# Altium schematic sheet DTYS_BLOOD_PRESURE_Sch.SchDoc
size 297 x 209 mm; SheetNumber: 1; SheetTotal: 1
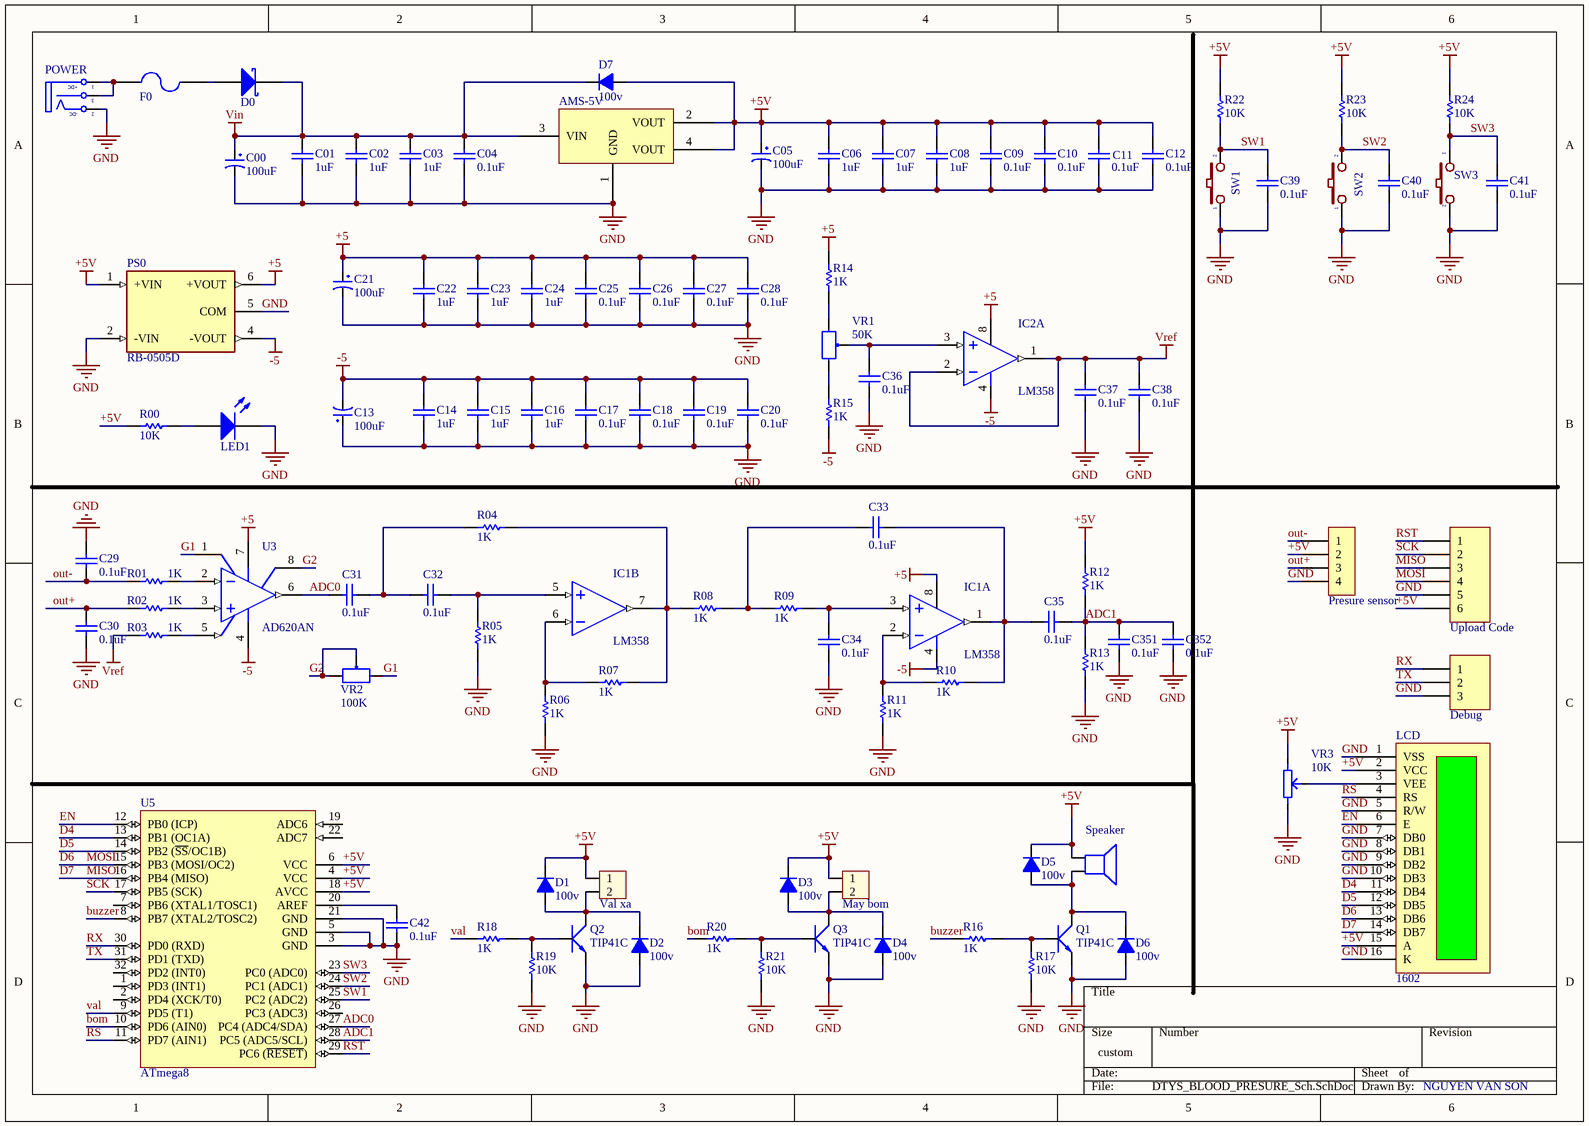
[diagram p0: DTYS_BLOOD_PRESURE_Sch.SchDoc]

## Parts
AMS-5V  AMS1117-5V  [SOT223]  (value not drawn)
C00  100uF  [tu tantalum smd7343]
C01  value 1uF  [CAP-SM-0805]  (hidden comment: Cap Non-Pol SMD)
C02  value 1uF  [CAP-SM-0805]  (hidden comment: Cap Non-Pol SMD)
C03  value 1uF  [CAP-SM-0805]  (hidden comment: Cap Non-Pol SMD)
C04  value 0.1uF  [CAP-SM-0805]  (hidden comment: Cap Non-Pol SMD)
C05  100uF  [tu tantalum smd3528]
C06  value 1uF  [CAP-SM-0805]  (hidden comment: Cap Non-Pol SMD)
C07  value 1uF  [CAP-SM-0805]  (hidden comment: Cap Non-Pol SMD)
C08  value 1uF  [CAP-SM-0805]  (hidden comment: Cap Non-Pol SMD)
C09  value 0.1uF  [CAP-SM-0805]  (hidden comment: Cap Non-Pol SMD)
C10  value 0.1uF  [CAP-SM-0805]  (hidden comment: Cap Non-Pol SMD)
C11  value 0.1uF  [CAP-SM-0805]  (hidden comment: Cap Non-Pol SMD)
C12  value 0.1uF  [CAP-SM-0805]  (hidden comment: Cap Non-Pol SMD)
C13  100uF  [tu tantalum smd3528]
C14  value 1uF  [CAP-SM-0805]  (hidden comment: Cap Non-Pol SMD)
C15  value 1uF  [CAP-SM-0805]  (hidden comment: Cap Non-Pol SMD)
C16  value 1uF  [CAP-SM-0805]  (hidden comment: Cap Non-Pol SMD)
C17  value 0.1uF  [CAP-SM-0805]  (hidden comment: Cap Non-Pol SMD)
C18  value 0.1uF  [CAP-SM-0805]  (hidden comment: Cap Non-Pol SMD)
C19  value 0.1uF  [CAP-SM-0805]  (hidden comment: Cap Non-Pol SMD)
C20  value 0.1uF  [CAP-SM-0805]  (hidden comment: Cap Non-Pol SMD)
C21  100uF  [tu tantalum smd3528]
C22  value 1uF  [CAP-SM-0805]  (hidden comment: Cap Non-Pol SMD)
C23  value 1uF  [CAP-SM-0805]  (hidden comment: Cap Non-Pol SMD)
C24  value 1uF  [CAP-SM-0805]  (hidden comment: Cap Non-Pol SMD)
C25  value 0.1uF  [CAP-SM-0805]  (hidden comment: Cap Non-Pol SMD)
C26  value 0.1uF  [CAP-SM-0805]  (hidden comment: Cap Non-Pol SMD)
C27  value 0.1uF  [CAP-SM-0805]  (hidden comment: Cap Non-Pol SMD)
C28  value 0.1uF  [CAP-SM-0805]  (hidden comment: Cap Non-Pol SMD)
C29  value 0.1uF  [CAP-SM-0805]  (hidden comment: Cap Non-Pol SMD)
C30  value 0.1uF  [CAP-SM-0805]  (hidden comment: Cap Non-Pol SMD)
C31  value 0.1uF  [CAP-SM-0805]  (hidden comment: Cap Non-Pol SMD)
C32  value 0.1uF  [CAP-SM-0805]  (hidden comment: Cap Non-Pol SMD)
C33  value 0.1uF  [CAP-SM-0805]  (hidden comment: Cap Non-Pol SMD)
C34  value 0.1uF  [CAP-SM-0805]  (hidden comment: Cap Non-Pol SMD)
C35  value 0.1uF  [CAP-SM-0805]  (hidden comment: Cap Non-Pol SMD)
C36  value 0.1uF  [CAP-SM-0805]  (hidden comment: Cap Non-Pol SMD)
C37  value 0.1uF  [CAP-SM-0805]  (hidden comment: Cap Non-Pol SMD)
C38  value 0.1uF  [CAP-SM-0805]  (hidden comment: Cap Non-Pol SMD)
C39  value 0.1uF  [CAP-SM-0805]  (hidden comment: Cap Non-Pol SMD)
C40  value 0.1uF  [CAP-SM-0805]  (hidden comment: Cap Non-Pol SMD)
C41  value 0.1uF  [CAP-SM-0805]  (hidden comment: Cap Non-Pol SMD)
C42  value 0.1uF  [CAP-SM-0805]  (hidden comment: Cap Non-Pol SMD)
C351  value 0.1uF  [CAP-SM-0805]  (hidden comment: Cap Non-Pol SMD)
C352  value 0.1uF  [CAP-SM-0805]  (hidden comment: Cap Non-Pol SMD)
D0  D Schottky  [SS34]  (value not drawn)
D1  100v  [DIODE SMA]
D2  100v  [DIODE SMA]
D3  100v  [DIODE SMA]
D4  100v  [DIODE SMA]
D5  100v  [DIODE SMA]
D6  100v  [DIODE SMA]
D7  100v  [DIODE SMA]
Debug  Header 3  [JP3]  (value not drawn)
F0  Fuse  [FUSE SMD]  (value not drawn)
H1  May bom  [XH2.54M-2]
H2  Val xa  [XH2.54M-2]
H4  Presure sensor  [XH2.54M-4]
IC1  LM358  [DIP8]  (parts A,B of 2)
IC2  LM358  [DIP8]  (part A of 2)
LCD  1602  [LCD Display 16x2]
LED1  LED  [LED-5mm]  (value not drawn)
LS0  Speaker  [SPEAKER]
POWER  JACK DC 5.5  [JACK DC 5.5]  (value not drawn)
PS0  RB-0505D  [CONV_RB-0505D]
Q1  TIP41C  [TO220H1]
Q2  TIP41C  [TO220H1]
Q3  TIP41C  [TO220H1]
R00  value 10K  [RES-SM-0805]  (hidden comment: RESISTOR SMD)
R01  value 1K  [RES-SM-0805]  (hidden comment: RESISTOR SMD)
R02  value 1K  [RES-SM-0805]  (hidden comment: RESISTOR SMD)
R03  value 1K  [RES-SM-0805]  (hidden comment: RESISTOR SMD)
R04  value 1K  [RES-SM-0805]  (hidden comment: RESISTOR SMD)
R05  value 1K  [RES-SM-0805]  (hidden comment: RESISTOR SMD)
R06  value 1K  [RES-SM-0805]  (hidden comment: RESISTOR SMD)
R07  value 1K  [RES-SM-0805]  (hidden comment: RESISTOR SMD)
R08  value 1K  [RES-SM-0805]  (hidden comment: RESISTOR SMD)
R09  value 1K  [RES-SM-0805]  (hidden comment: RESISTOR SMD)
R10  value 1K  [RES-SM-0805]  (hidden comment: RESISTOR SMD)
R11  value 1K  [RES-SM-0805]  (hidden comment: RESISTOR SMD)
R12  value 1K  [RES-SM-0805]  (hidden comment: RESISTOR SMD)
R13  value 1K  [RES-SM-0805]  (hidden comment: RESISTOR SMD)
R14  value 1K  [RES-SM-0805]  (hidden comment: RESISTOR SMD)
R15  value 1K  [RES-SM-0805]  (hidden comment: RESISTOR SMD)
R16  value 1K  [RES-SM-0805]  (hidden comment: RESISTOR SMD)
R17  value 10K  [RES-SM-0805]  (hidden comment: RESISTOR SMD)
R18  value 1K  [RES-SM-0805]  (hidden comment: RESISTOR SMD)
R19  value 10K  [RES-SM-0805]  (hidden comment: RESISTOR SMD)
R20  value 1K  [RES-SM-0805]  (hidden comment: RESISTOR SMD)
R21  value 10K  [RES-SM-0805]  (hidden comment: RESISTOR SMD)
R22  value 10K  [RES-SM-0805]  (hidden comment: RESISTOR SMD)
R23  value 10K  [RES-SM-0805]  (hidden comment: RESISTOR SMD)
R24  value 10K  [RES-SM-0805]  (hidden comment: RESISTOR SMD)
SW1  SW  [SW1-DIP]  (value not drawn)
SW2  SW  [SW1-DIP]  (value not drawn)
SW3  SW  [SW1-DIP]  (value not drawn)
U3  AD620AN  [DIP8]
U5  ATmega8  [TQFP32]
Upload_Code  Header 6  [JP6]  (value not drawn)
VR1  50K  [Bien Tro Vi Chinh Dung]
VR2  100K  [Bien Tro Vi Chinh Dung]
VR3  10K  [Bien Tro Tam Giac Dung]

## Nets
+5: C21.1 C22.2 C23.2 C24.2 C25.2 C26.2 C27.2 C28.2 IC1.8(+V) IC2.8(+V) PS0.6(+VOUT) R14.2 U3.7(V+)
+5V: AMS-5V.2(VOUT) AMS-5V.4(VOUT) C05.1 C06.2 C07.2 C08.2 C09.2 C10.2 C11.2 C12.2 D1.2(K) D3.2(K) D5.2(K) D7.1(A) H1.1 H2.1 H4.2 LCD.2(VCC) LCD.15(A) LS0.1 PS0.1(+VIN) R00.2 R12.1 R22.2 R23.2 R24.2 U5.4(VCC) U5.6(VCC) U5.18(AVCC) Upload_Code.6 VR3.3
-5: C13.2 C14.2 C15.2 C16.2 C17.2 C18.2 C19.2 C20.2 IC1.4(-V) IC2.4(-V) PS0.4(-VOUT) R15.1 U3.4(V-)
GND: AMS-5V.1(GND) C00.2 C01.1 C02.1 C03.1 C04.1 C05.2 C06.1 C07.1 C08.1 C09.1 C10.1 C11.1 C12.1 C13.1 C14.1 C15.1 C16.1 C17.1 C18.1 C19.1 C20.1 C21.2 C22.1 C23.1 C24.1 C25.1 C26.1 C27.1 C28.1 C29.2 C30.1 C34.1 C36.2 C37.1 C38.1 C39.1 C40.1 C41.1 C42.2 C351.2 C352.2 D2.1(A) D4.1(A) D6.1(A) Debug.3 H4.4 LCD.1(VSS) LCD.5(R/W) LCD.7(DB0) LCD.8(DB1) LCD.9(DB2) LCD.10(DB3) LCD.16(K) LED1.2(K) POWER.2(TN) PS0.2(-VIN) PS0.5(COM) Q1.3(E) Q2.3(E) Q3.3(E) R05.1 R06.2 R11.2 R13.2 R17.2 R19.2 R21.2 SW1.1 SW2.1 SW3.2 U5.3(GND) U5.5(GND) U5.21(GND) Upload_Code.5 VR3.1
Vin: AMS-5V.3(VIN) C00.1 C01.2 C02.2 C03.2 C04.2 D0.2(K) D7.2(K)
Vref: C37.2 C38.2 IC2.1(OUT) IC2.2(IN-) R03.2
ADC0: C31.2 U3.6(OUT) U5.27(PC4_(ADC4/SDA))
ADC1: C35.1 C351.1 C352.1 R12.2 R13.1 U5.28(PC5_(ADC5/SCL))
bom: R20.2 U5.10(PD6_(AIN0))
buzzer: R16.2 U5.8(PB7_(XTAL2/TOSC2))
D4: LCD.11(DB4) U5.13(PB1_(OC1A))
D5: LCD.12(DB5) U5.14(PB2_(~{SS}/OC1B))
D6: LCD.13(DB6) U5.15(PB3_(MOSI/OC2)) Upload_Code.4  [also labelled MOSI]
D7: LCD.14(DB7) U5.16(PB4_(MISO)) Upload_Code.3  [also labelled MISO]
EN: LCD.6(E) U5.12(PB0_(ICP))
G1: U3.1(RG) VR2.3
G2: U3.8(RG) VR2.1 VR2.2
out+: C30.2 H4.3 R02.2
out-: C29.1 H4.1 R01.2
RS: LCD.4(RS) U5.11(PD7_(AIN1))
RST: U5.29(PC6_(~{RESET})) Upload_Code.1
RX: Debug.1 U5.30(PD0_(RXD))
SCK: U5.17(PB5_(SCK)) Upload_Code.2
SW1: C39.2 R22.1 SW1.2 U5.25(PC2_(ADC2))
SW2: C40.2 R23.1 SW2.2 U5.24(PC1_(ADC1))
SW3: C41.2 R24.1 SW3.1 U5.23(PC0_(ADC0))
TX: Debug.2 U5.31(PD1_(TXD))
val: R18.2 U5.9(PD5_(T1))
NetC31_1: C31.1 C32.1 R04.2
NetC32_2: C32.2 IC1.5(IN+) R05.2
NetC33_1: C33.1 R08.1 R09.2
NetC33_2: C33.2 C35.2 IC1.1(OUT) R10.2
NetC34_2: C34.2 IC1.3(IN+) R09.1
NetC36_1: C36.1 IC2.3(IN+) VR1.2
NetC42_1: C42.1 U5.20(AREF)
NetD0_1: D0.1(A) F0.2
NetD1_1: D1.1(A) D2.2(K) H2.2 Q2.2(C)
NetD3_1: D3.1(A) D4.2(K) H1.2 Q3.2(C)
NetD5_1: D5.1(A) D6.2(K) LS0.2 Q1.2(C)
NetF0_1: F0.1 POWER.1(T) POWER.3(S)
NetIC1_2: IC1.2(IN-) R10.1 R11.1
NetIC1_6: IC1.6(IN-) R06.1 R07.1
NetIC1_7: IC1.7(OUT) R04.1 R07.2 R08.2
NetLCD_3: LCD.3(VEE) VR3.2
NetLED1_1: LED1.1(A) R00.1
NetQ1_1: Q1.1(B) R16.1 R17.1
NetQ2_1: Q2.1(B) R18.1 R19.1
NetQ3_1: Q3.1(B) R20.1 R21.1
NetR01_1: R01.1 U3.2(-IN)
NetR02_1: R02.1 U3.3(+IN)
NetR03_1: R03.1 U3.5(REF)
NetR14_1: R14.1 VR1.1
NetR15_2: R15.2 VR1.3

Not connected (* = marked no-connect by the designer): U5 1(PD3_(INT1)) 2(PD4_(XCK/T0)) 7(PB6_(XTAL1/TOSC1)) 19(ADC6) 22(ADC7) 26(PC3_(ADC3)) 32(PD2_(INT0))

## Notes on the sheet
- NGUYEN VAN SON
- (in symbol JACK DC 5.5) +DC; -DC

## Library data of the parts
AMS-5V = AMS1117 SMD: Dán; Value: AMS1117-3.3V SOT223; Don_Vi: Con; Ma_Hang: MH000596; Ghi_Chu: *; Kieu_Chan: *; Chung_Loai: Dán
C00 = Tu tantalum 100uF 50V SMD7343: Dán; Don_Vi: Con; So_Chan: 2; Ten_Linh_Kien: Tụ tantalum 107T-100uF 50V SMD7343; Ma_Hang: MH008401; Chung_Loai: Dán; Kieu_Chan: *
C01 C02 C03 C04 C06 C07 C08 C09-C12 C14-C20 C22-C42 C351 C352 = Cap Non-Pol SMD: Capacitor
C05 C13 C21 = Tu tantalum 100uF 10V SMD6032: Dán; Don_Vi: Con; So_Chan: 2; Ten_Linh_Kien: Tụ tantalum 107A-100uF 10V SMD6032; Ma_Hang: MH007594; Chung_Loai: Dán; Kieu_Chan: *
D0 = D Schottky: Schottky Diode; Published: 8-Jun-2000; LatestRevisionDate: 17-Jul-2002; LatestRevisionNote: Re-released for DXP Platform.; PackageReference: SMB; Publisher: Altium Limited; PackageDescription: DO-214-AA/SMB; 2 C-Bend Leads; Body 5.3 x 3.6 mm, inc. leads (LxW); Code_JEDEC: DO-214-AA
D1-D7 = Diode 1N4007: Cắm; Ten_Linh_Kien: Diode 1N4007 1A (DIP); Don_Vi: Con; Ma_Hang: MH001063; Ghi Chu: *; Kieu_Chan: *; Chung_Loai: Cắm
Debug = Header 3: Header, 3-Pin; LatestRevisionDate: 17-Jul-2002; LatestRevisionNote: Re-released for DXP Platform.; Publisher: Altium Limited
H1 H2 = Header 2P 2.54 Duc Thang: Cắm; Ten_Linh_Kien: Header 2P XH2.54-2P Đực Thẳng; Don_Vi: Con; Ma_Hang: MH001283; Chung_Loai: Cắm
H4 = Header 4P 2.54 Duc Thang: Cắm; Ten_Linh_Kien: Header 4P XH2.54-4P Đực Thẳng; Don_Vi: Con; Ma_Hang: MH001285; Chung_Loai: Cắm
IC1 IC2 = LM358: Low-Power Dual Operational Amplifier; Value: LM358
LCD = LCD 1602: LCD 1602 Display
LS0 = Speaker: Loudspeaker; Published: 24-Mar-1999; LatestRevisionDate: 17-Jul-2002; LatestRevisionNote: Re-released for DXP Platform.; PackageReference: PIN2; Publisher: Altium Limited
POWER = JACK DC 5.5: Value: Jac DC
PS0 = RB-0505D: 1W DC/DC-Converter 'ECONOLINE' SIP7 1kV unreg; MF: Recom Power; Check_prices: https://www.snapeda.com/parts/RB-0505D/Recom+Power/view-part/?ref=eda; Package: None; Price: None; Value: *; MP: RB-0505D; Purchase-URL: https://pricing.snapeda.com/search/part/RB-0505D/?ref=eda; Availability: In Stock; SnapEDA_Link: https://www.snapeda.com/parts/RB-0505D/Recom+Power/view-part/?ref=snap
Q1-Q3 = TIP41C: NPN 2W, BCE; Value: TIP41C
R00 R01 R02 R03 R04 R05 R06 R07 R08 R09-R24 = RESISTOR SMD: Resistor
SW1-SW3 = SW2: Switch button 2 pin; Value: SW chip 2 pin
U3 = AD620AN: Low-Cost, Low-Power Instrumentation Amplifier; Published: 8-Jun-2000; LatestRevisionDate: 04-Mar-2005; LatestRevisionNote: Stylized 3D Model Added.; DatasheetVersion: REV.D 1998; PackageVersion: revA; PackageReference: N-8; Publisher: Altium Limited; PackageDescription: DIP; 8 Leads; Row Spacing 7.62 mm; Pitch 2.54 mm; ComponentLink1Description: Manufacturer Link; ComponentLink1URL: http://www.analog.com/en/prod/0%2C2877%2CAD620%2C00.html; ComponentLink2Description: Datasheet; ComponentLink2URL: http://www.analog.com/UploadedFiles/Data_Sheets/897653854AD620_g.pdf
U5 = ATmega8A-AU: 8-Bit AVR Microcontroller with 8K Bytes of In-System Programmable Flash Memory; Value: ATmega8-L
Upload_Code = Header 6: Header, 6-Pin; LatestRevisionDate: 17-Jul-2002; LatestRevisionNote: Re-released for DXP Platform.; Publisher: Altium Limited
VR1 VR2 = Bien Tro Tinh Chinh 1K Dung: Cắm; Don_Vi: Con; Ten_Linh_Kien: Biến Trở VR 102-1K 3296W; Ma_Hang: MH003234; Kieu_Chan: *; Chung_Loai: Cắm
VR3 = Bien tro tam giac 10K Dung: Cắm; Ma_Hang: MH000919; Don_Vi: Con; Ten_Linh_Kien: Biến Trở Tam Giác 103-10K RM065 (Chân Đứng); Chung_Loai: Cắm; Kieu_Chan: *